# EAGLE schematic spuung-ap-v_0_0_1a (EAGLE 6.4)

## Sheet 1 of 8: Jacks
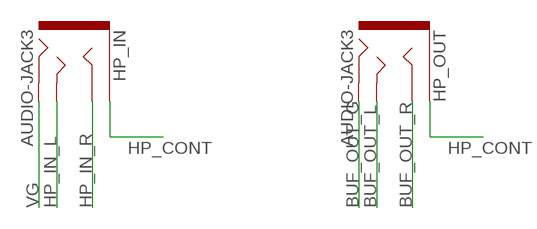
[diagram p0: schematic, sheet 1]

### Parts
HP_IN  AUDIO-JACK3  [AUDIO-JACK-TRRS-SMD]
HP_OUT  AUDIO-JACK3  [AUDIO-JACK-TRRS-SMD]

### Nets
BUF_OUT_G: HP_OUT.RING2
BUF_OUT_L: HP_OUT.TIP ; also sheet 3,4,5
BUF_OUT_R: HP_OUT.RING1 ; also sheet 3,4,6
HP_CONT: HP_IN.EARTH HP_OUT.EARTH
HP_IN_L: HP_IN.TIP ; also sheet 2
HP_IN_R: HP_IN.RING1 ; also sheet 2
VG: HP_IN.RING2 ; also sheet 2,5,6

## Sheet 2 of 8: Volume Pot
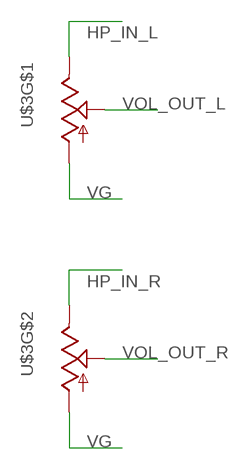
[diagram p1: schematic, sheet 2]

### Parts
U$3  ALPS_BLUE  [ALPS_RK27]

### Nets
HP_IN_L: U$3.I1 ; also sheet 1
HP_IN_R: U$3.I2 ; also sheet 1
VG: U$3.G1 U$3.G2 ; also sheet 1,5,6
VOL_OUT_L: U$3.O1 ; also sheet 5
VOL_OUT_R: U$3.O2 ; also sheet 6

## Sheet 3 of 8: Bass Pot
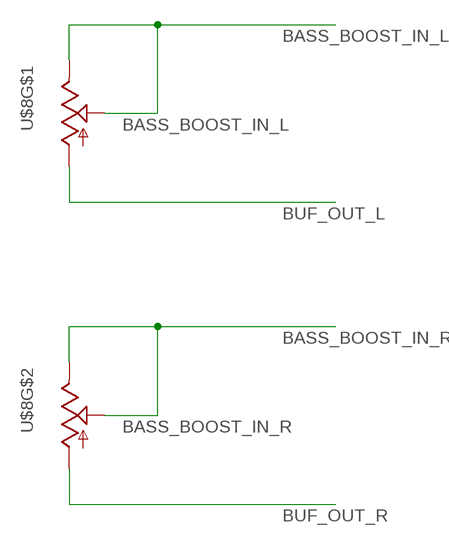
[diagram p2: schematic, sheet 3]

### Parts
U$8  ALPS_BLUE  [ALPS_RK27]

### Nets
BASS_BOOST_IN_L: U$8.I1 U$8.O1 ; also sheet 4,5
BASS_BOOST_IN_R: U$8.I2 U$8.O2 ; also sheet 4,6
BUF_OUT_L: U$8.G1 ; also sheet 1,4,5
BUF_OUT_R: U$8.G2 ; also sheet 1,4,6

## Sheet 4 of 8: Bass Enable
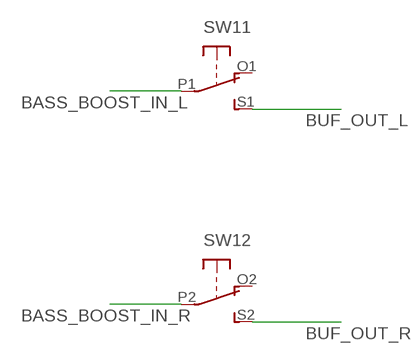
[diagram p3: schematic, sheet 4]

### Parts
SW1  DPDT-EG1390  [EG1390]

### Nets
BASS_BOOST_IN_L: SW1.P1(1:P) ; also sheet 3,5
BASS_BOOST_IN_R: SW1.P2(2:P) ; also sheet 3,6
BUF_OUT_L: SW1.S1(1:S) ; also sheet 1,3,5
BUF_OUT_R: SW1.S2(2:S) ; also sheet 1,3,6
Unconnected: SW1.O1(1:O) SW1.O2(2:O)

## Sheet 5 of 8: Left Amp
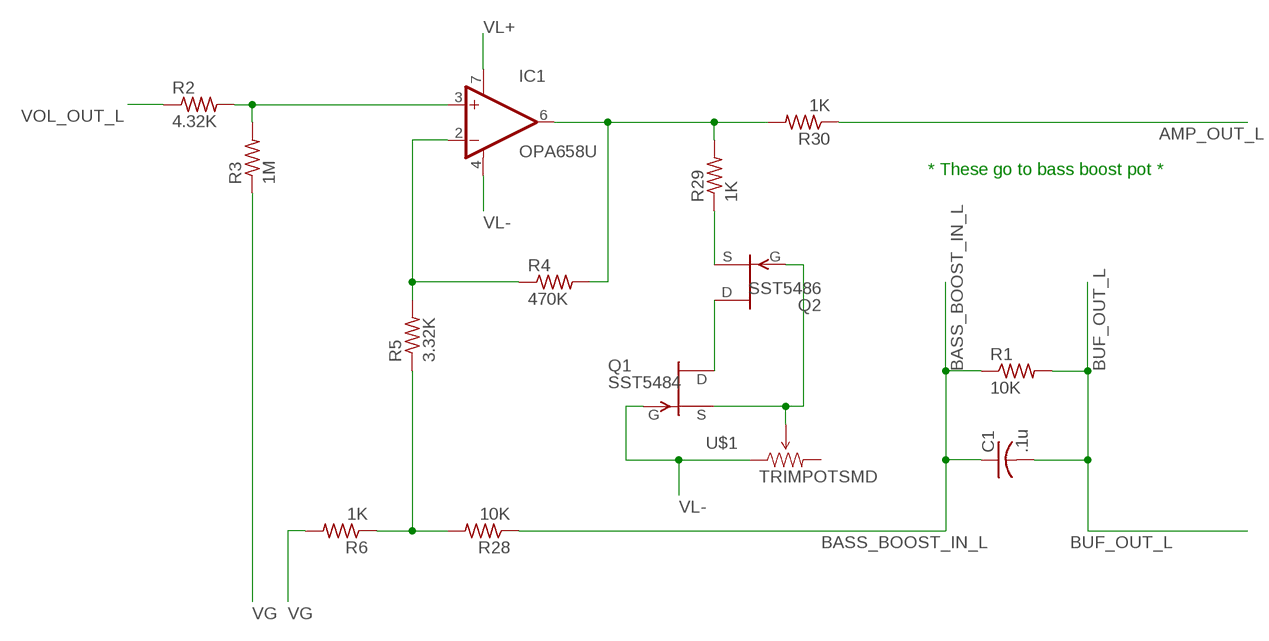
[diagram p4: schematic, sheet 5]

### Parts
C1  .1u  C-USC0805  [C0805]
IC1  OPA658U  [SO08]
Q1  SST5484  [SOT23]
Q2  SST5486  [SOT23]
R1  10K  R-US_R0805  [R0805]
R2  4.32K  R-US_R0805  [R0805]
R3  1M  R-US_R0805  [R0805]
R4  470K  R-US_R0805  [R0805]
R5  3.32K  R-US_R0805  [R0805]
R6  1K  R-US_R0805  [R0805]
R28  10K  R-US_R0805  [R0805]
R29  1K  R-US_R0805  [R0805]
R30  1K  R-US_R0805  [R0805]
U$1  TRIMPOTSMD  [TRIMPOT-3MM]

### Nets
AMP_OUT_L: R30.1 ; also sheet 7
BASS_BOOST_IN_L: C1.1 R1.1 R28.1 ; also sheet 3,4
BUF_OUT_L: C1.2 R1.2 ; also sheet 1,3,4
N$2: Q2.2(S) R29.1
N$6: IC1.3(+IN) R2.2 R3.2
N$7: IC1.2(-IN) R4.1 R5.2
N$9: Q1.1(D) Q2.1(D)
N$11: Q1.2(S) Q2.3(G) U$1.2(WIPER)
N$12: IC1.6(OUT) R4.2 R29.2 R30.2
N$14: R5.1 R6.1 R28.2
VG: R3.1 R6.2 ; also sheet 1,2,6
VL+: IC1.7(V+)
VL-: IC1.4(V-) Q1.3(G) U$1.1(CCW)
VOL_OUT_L: R2.1 ; also sheet 2
Unconnected: U$1.3(CW)

### Notes on the sheet
- * These go to bass boost pot *

## Sheet 6 of 8: Right Amp
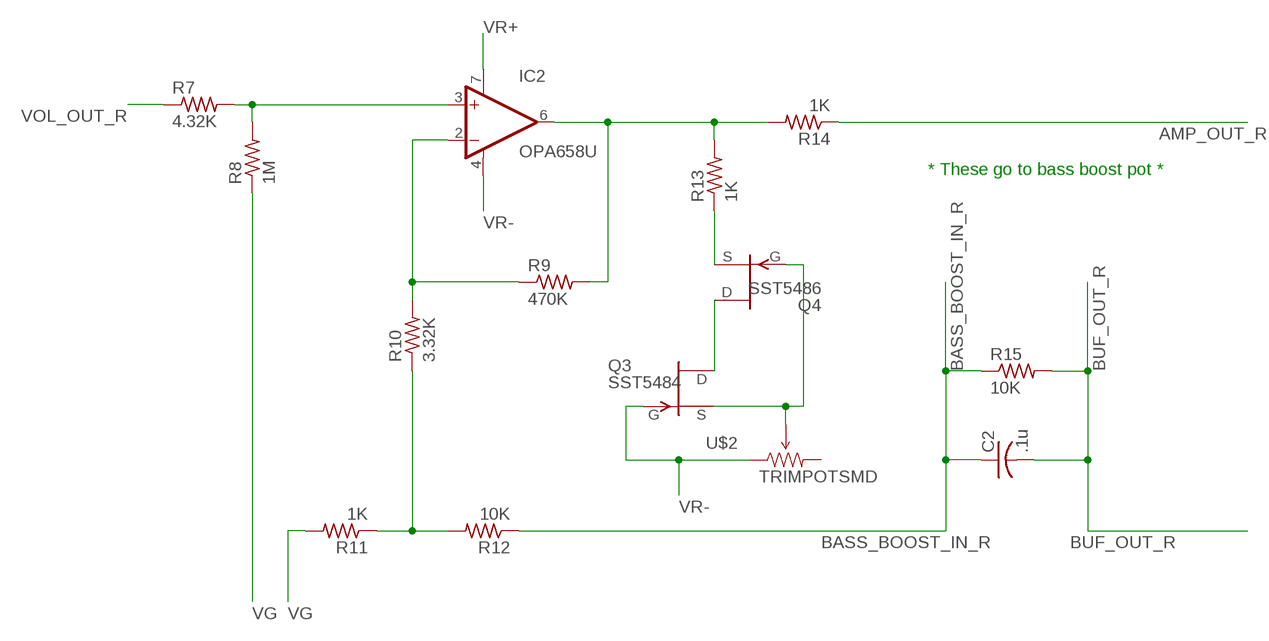
[diagram p5: schematic, sheet 6]

### Parts
C2  .1u  C-USC0805  [C0805]
IC2  OPA658U  [SO08]
Q3  SST5484  [SOT23]
Q4  SST5486  [SOT23]
R7  4.32K  R-US_R0805  [R0805]
R8  1M  R-US_R0805  [R0805]
R9  470K  R-US_R0805  [R0805]
R10  3.32K  R-US_R0805  [R0805]
R11  1K  R-US_R0805  [R0805]
R12  10K  R-US_R0805  [R0805]
R13  1K  R-US_R0805  [R0805]
R14  1K  R-US_R0805  [R0805]
R15  10K  R-US_R0805  [R0805]
U$2  TRIMPOTSMD  [TRIMPOT-3MM]

### Nets
AMP_OUT_R: R14.1 ; also sheet 8
BASS_BOOST_IN_R: C2.1 R12.1 R15.1 ; also sheet 3,4
BUF_OUT_R: C2.2 R15.2 ; also sheet 1,3,4
N$15: IC2.3(+IN) R7.2 R8.2
N$16: IC2.2(-IN) R9.1 R10.2
N$18: IC2.6(OUT) R9.2 R13.2 R14.2
N$19: R10.1 R11.1 R12.2
N$20: Q4.2(S) R13.1
N$21: Q3.1(D) Q4.1(D)
N$22: Q3.2(S) Q4.3(G) U$2.2(WIPER)
VG: R8.1 R11.2 ; also sheet 1,2,5
VOL_OUT_R: R7.1 ; also sheet 2
VR+: IC2.7(V+)
VR-: IC2.4(V-) Q3.3(G) U$2.1(CCW)
Unconnected: U$2.3(CW)

### Notes on the sheet
- * These go to bass boost pot *

## Sheet 7 of 8: Left Buffer
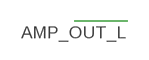
[diagram p6: schematic, sheet 7]

## Sheet 8 of 8: Right Buffer
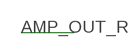
[diagram p7: schematic, sheet 8]

## Library data of the parts
C1 C2 = rcl:C-US: CAPACITOR, American symbol
HP_IN HP_OUT = SparkFun-Connectors:AUDIO-JACK3: Audio jack - 3.5mm TRRS variety - two rings.
IC1 IC2 = burr-brown:OPA658: Operational Amplifier Wideband, Low Power, Current Feedback; MPN: AD8001ARZ; OC_FARNELL: unknown; OC_NEWARK: 19M0912
Q1-Q4 = transistor-fet:?548*: N-Channel JFETs Source: VISHAY 2N5484.pdf Compatible: TO92 2N5245 J304 J305 U310 J308 J309 J310 TO72 2N4416 2N4416A 2N3823 2N4351 3N169 3N170 3N171 MFE3002 TO18 2N3796 2N3797 MFE825 Source: Motorola European Master Guide Pacge 3-59
R1-R15 R28-R30 = rcl:R-US_: RESISTOR, American symbol
SW1 = adafruit:DPDT
U$1 U$2 = SparkFun:TRIMPOT
U$3 U$8 = audio-pots:ALPS_BLUE: Alps Blue potentiometer